# Altium project TechDemo.PrjPcb (part 2 of 2)

## Sheet Wifi.SchDoc: =ProjectTitle
size B; Date: 10/29/2020; Engineer: H. Collector; Organization: IMR Engineering; Address1: 3621 Gin Way; Address2: Snellville, GA 30039; Address3: USA; DocumentNumber: IMR_002; Revision: 1; SheetNumber: 9; SheetTotal: 10
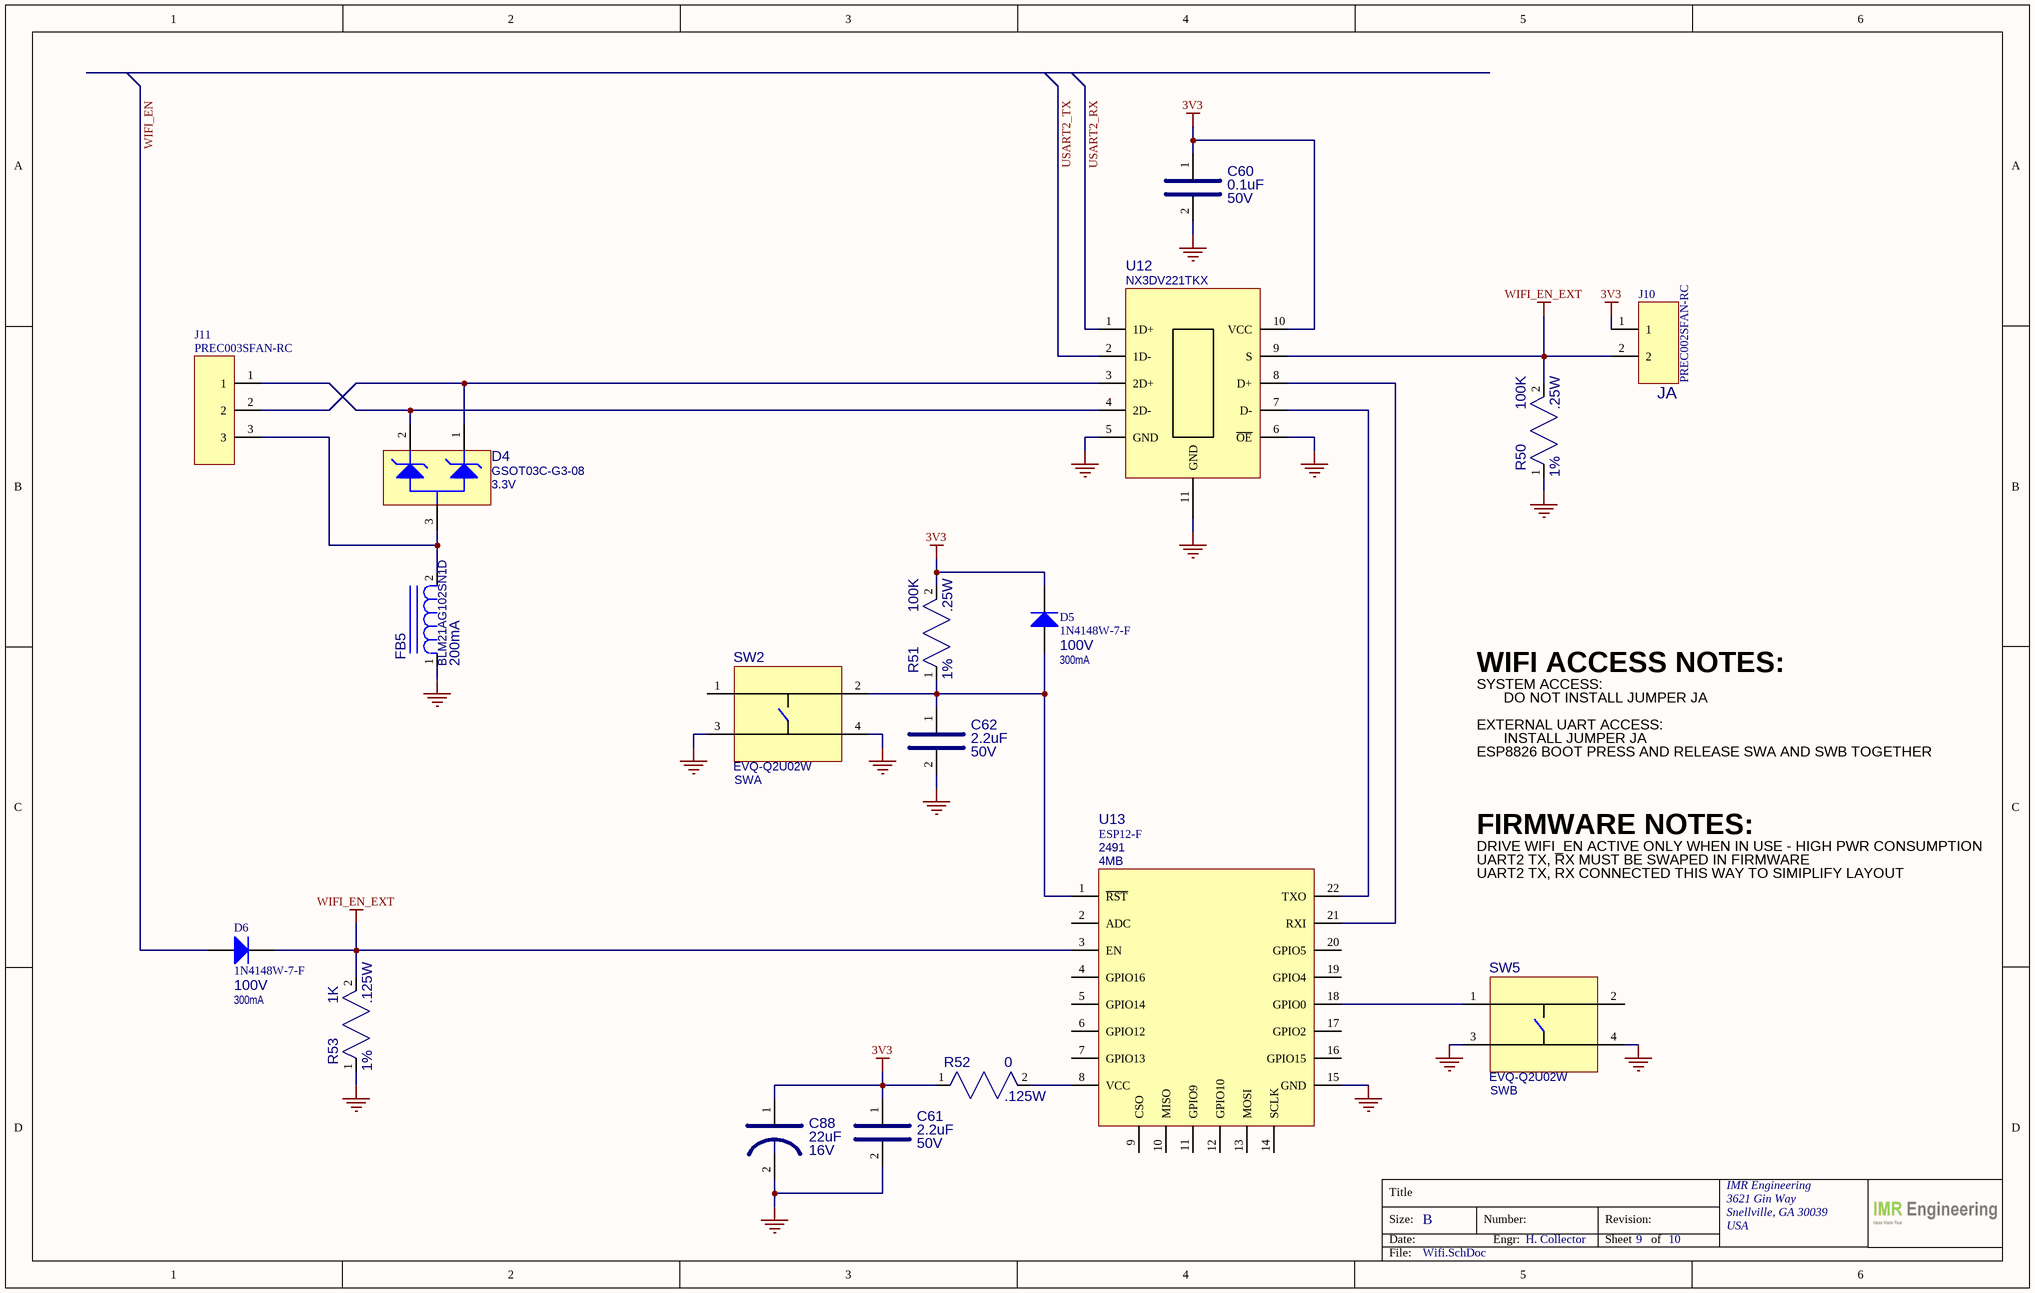
[diagram p8: Wifi.SchDoc]

### Parts
C60  value 0.1uF  VOLTAGE: 50V  [CAP_0805]  (hidden comment: 08055C104KAT2A)
C61  value 2.2uF  VOLTAGE: 50V  [CAP_0805]  (hidden comment: UMK212BB7225MG-T)
C62  value 2.2uF  VOLTAGE: 50V  [CAP_0805]  (hidden comment: UMK212BB7225MG-T)
C88  value 22uF  VOLTAGE: 16V  [CAP_2312]  (hidden comment: TRJC226K016RRJ)
D4  value 3.3V  [SOT-23]  (hidden comment: GSOT03C-G3-08)
D5  value 100V  CURRENT: 300mA  [SOD123]  (hidden comment: 1N4148W-7-F)
D6  value 100V  CURRENT: 300mA  [SOD123]  (hidden comment: 1N4148W-7-F)
FB5  value 200mA  [RES_0805]  (hidden comment: BLM21AG102SN1D)
J10  PREC002SFAN-RC  OPERATION_NOTE: JA  [HDR_1X2_100MILL]
J11  PREC003SFAN-RC  [HDR_1X3_100MILL]
R50  value 100K  TOLERANCE: 1%  POWER: .25W  [PMG_RES_0805]  (hidden comment: RK73H2ATTD1003F)
R51  value 100K  TOLERANCE: 1%  POWER: .25W  [PMG_RES_0805]  (hidden comment: RK73H2ATTD1003F)
R52  value 0  POWER: .125W  [PMG_RES_0805]  (hidden comment: RC0805JR-070RL)
R53  value 1K  TOLERANCE: 1%  POWER: .125W  [RES_0805]  (hidden comment: RC0805FR-071KL)
SW2  OPERATION_NOTE: SWA  [SW_EVQ-Q2U02W]  (hidden comment: EVQ-Q2U02W)
SW5  OPERATION_NOTE: SWB  [SW_EVQ-Q2U02W]  (hidden comment: EVQ-Q2U02W)
U12  NX3DV221TKX  [PMG_NX3DV221TKX]
U13  PACKAGE: ESP12-F  FLASH: 4MB  [XCVR_ESP8266-12E/ESP-12E]  (hidden comment: 2491)

### Nets
3V3: C60.1 C61.1 C88.1 D5.2(K) J10.1 R51.2 R52.1 U12.10(VCC)
GND: C60.2 C61.2 C62.2 C88.2 FB5.1 R50.1 R53.1 SW2.3(A) SW2.4(A') SW5.3(A) SW5.4(A') U12.5(GND) U12.6(~{OE}) U12.11(GND) U13.15(GND)
WIFI_EN_EXT: D6.2(K) J10.2 R50.2 R53.2 U12.9(S) U13.3(EN)
USART2_RX: U12.1(1D+)
USART2_TX: U12.2(1D-)
WIFI_EN: D6.1(A)
NetC62_1: C62.1 D5.1(A) R51.1 SW2.2(B') U13.1(~{RST})
NetD4_1: D4.1(A1) J11.2 U12.3(2D+)
NetD4_2: D4.2(A2) J11.1 U12.4(2D-)
NetD4_3: D4.3(A) FB5.2 J11.3
NetR52_2: R52.2 U13.8(VCC)
NetSW5_1: SW5.1(B) U13.18(GPIO0)
NetU12_7: U12.7(D-) U13.22(TXO)
NetU12_8: U12.8(D+) U13.21(RXI)

Not connected (* = marked no-connect by the designer): SW2 1(B); SW5 2(B'); U13 2(ADC) 4(GPIO16) 5(GPIO14) 6(GPIO12) 7(GPIO13) 9(CSO) 10(MISO) 11(GPIO9) 12(GPIO10) 13(MOSI) 14(SCLK) 16(GPIO15) 17(GPIO2) 19(GPIO4) 20(GPIO5)

### Notes on the sheet
- WIFI ACCESS NOTES:
- SYSTEM ACCESS:
- DO NOT INSTALL JUMPER JA
- EXTERNAL UART ACCESS:
- ESP8826 BOOT PRESS AND RELEASE SWA AND SWB TOGETHER
- INSTALL JUMPER JA
- FIRMWARE NOTES:
- DRIVE WIFI_EN ACTIVE ONLY WHEN IN USE - HIGH PWR CONSUMPTION
- UART2 TX, RX MUST BE SWAPED IN FIRMWARE
- UART2 TX, RX CONNECTED THIS WAY TO SIMIPLIFY LAYOUT
- Title
- Size:
- Date:
- B
- Number:
- Engr:
- Revision:
- Sheet
- of
- File:

### Library data of the parts
C60 = CAP_0.1UF_50V_0805: CAP CER 0.1UF 50V X7R 0805; MFG: AVX; TOLERANCE: 10%; MFG_PN: 08055C104KAT2A; Supplier 1: Digi-Key; Supplier Part Number 1: 478-1395-1-ND; Case/Package: 0805
C61 C62 = CAP_2.2UF_50V_0805: CAP CER 2.2UF 50V X7R 0805; MFG: Taiyo Yuden; TOLERANCE: 20%; MFG_PN: UMK212BB7225MG-T; Supplier 1: Digi-Key; Supplier Part Number 1: 587-4963-1-ND; Case/Package: 0805
C88 = CAP_22UF_16V_TANT: CAP TANT 22UF 10% 16V 2312; MFG: AVX Corporation; MFG_PN: TRJC226K016RRJ; TOLERANCE: 10%; Supplier 1: Digi-Key; Supplier Part Number 1: 478-11127-1-ND
D4 = DIODE_TVS_GSOT03C-G3-08: TVS DIODE 3.3V 12.3V SOT23; MFG: Vishay Semiconductor; POWER: 30A (8/20us); Case/Package: SOT-23; Supplier 1: Digi-Key; Supplier Part Number 1: GSOT03C-G3-08GICT-ND; MFG_PN: GSOT03C-G3-08
D5 D6 = DIODE_1N4148W-7-F: DIODE GEN PURP 100V 300MA SOD123; MFG: Diodes Incorporated; Case/Package: SOD-123; Supplier 1: Digi-Key; Supplier Part Number 1: 1N4148W-FDICT-ND; MFG_PN: 1N4148W-7-F
FB5 = FERRITE_BLM21AG102SN1D: FERRITE, 1KOHM AT 100MHZ, 220MA, .450DCR; MFG: MURATA; TOLERANCE: 10%; Supplier 1: Digi-Key; Supplier Part Number 1: 490-1041-1-ND; MFG_PN: BLM21AG102SN1D
J10 = CONN_2P_SINGLE_ROW: CONN HEADER VERT 2POS 2.54MM; MFG: Sullins Connector Solutions; Case/Package: 2P_2.54MM; MFG_PN: PREC002SFAN-RC; Supplier 1: Digi-Key; Supplier Part Number 1: S1212EC-02-ND; Value: *
J11 = CONN_3P_SINGLE_ROW: CONN HEADER VERT 3POS 2.54MM; MFG: Sullins Connector Solutions; Case/Package: 3P_2.54MM; MFG_PN: PREC003SFAN-RC; Supplier 1: Digi-Key; Supplier Part Number 1: S1212EC-03-ND; Value: *
R50 R51 = RES_100K_0805_1/4W_1%: RES SMD 100K OHM 1% 1/4W 0805; MFG: KOA Speer Electronics, Inc.; Case/Package: 0805; MFG_PN: RK73H2ATTD1003F; Supplier 1: Digi-Key; Supplier Part Number 1: 2019-RK73H2ATTD1003FCT-ND
R52 = RES_0_0805_1/8W: RES SMD 0 OHM JUMPER 1/8W 0805; MFG: Yageo; Case/Package: 0805; MFG_PN: RC0805JR-070RL; Supplier 1: Digi-Key; Supplier Part Number 1: 311-0.0ARCT-ND; TOLERANCE: JUMPER
R53 = RES_1K_0805_1/8W_1%: RES SMD 1K OHM 1% 1/8W 0805; MFG: Yageo; Case/Package: 0805; MFG_PN: RC0805FR-071KL; Supplier 1: Digi-Key; Supplier Part Number 1: 311-1.00KCRCT-ND
SW2 SW5 = SWITCH_EVQ-Q2U02W: SWITCH TACTILE SPST-NO 0.02A 15V; MFG: Panasonic Electronic Components; Case/Package: EVQ-Q2; Supplier 1: Digi-Key; Supplier Part Number 1: P12954SCT-ND; VALUE: 15V; MFG_PN: EVQ-Q2U02W
U12 = IC_NX3DV221TKX: IC USB 2.0 SWITCH HS 10HVSON; MFG: NXP USA Inc.; Case/Package: 10-DFN; Supplier 1: Digi-Key; Supplier Part Number 1: 568-10368-1-ND; MFG_PN: NX3DV221TKX
U13 = MODULE_2491: RX TXRX MOD WIFI TRACE ANT SMD 4MB; MFG: Adafruit Industries LLC; Supplier 1: Digi-Key; Supplier Part Number 1: 1528-1438-ND; Case/Package: ESP-12F; MFG_PN: 2491

## Sheet Power.SchDoc: =ProjectTitle
size B; Date: 10/29/2020; Engineer: H. Collector; Organization: IMR Engineering; Address1: 3621 Gin Way; Address2: Snellville, GA 30039; Address3: USA; DocumentNumber: IMR_002; Revision: 1; SheetNumber: 10; SheetTotal: 10
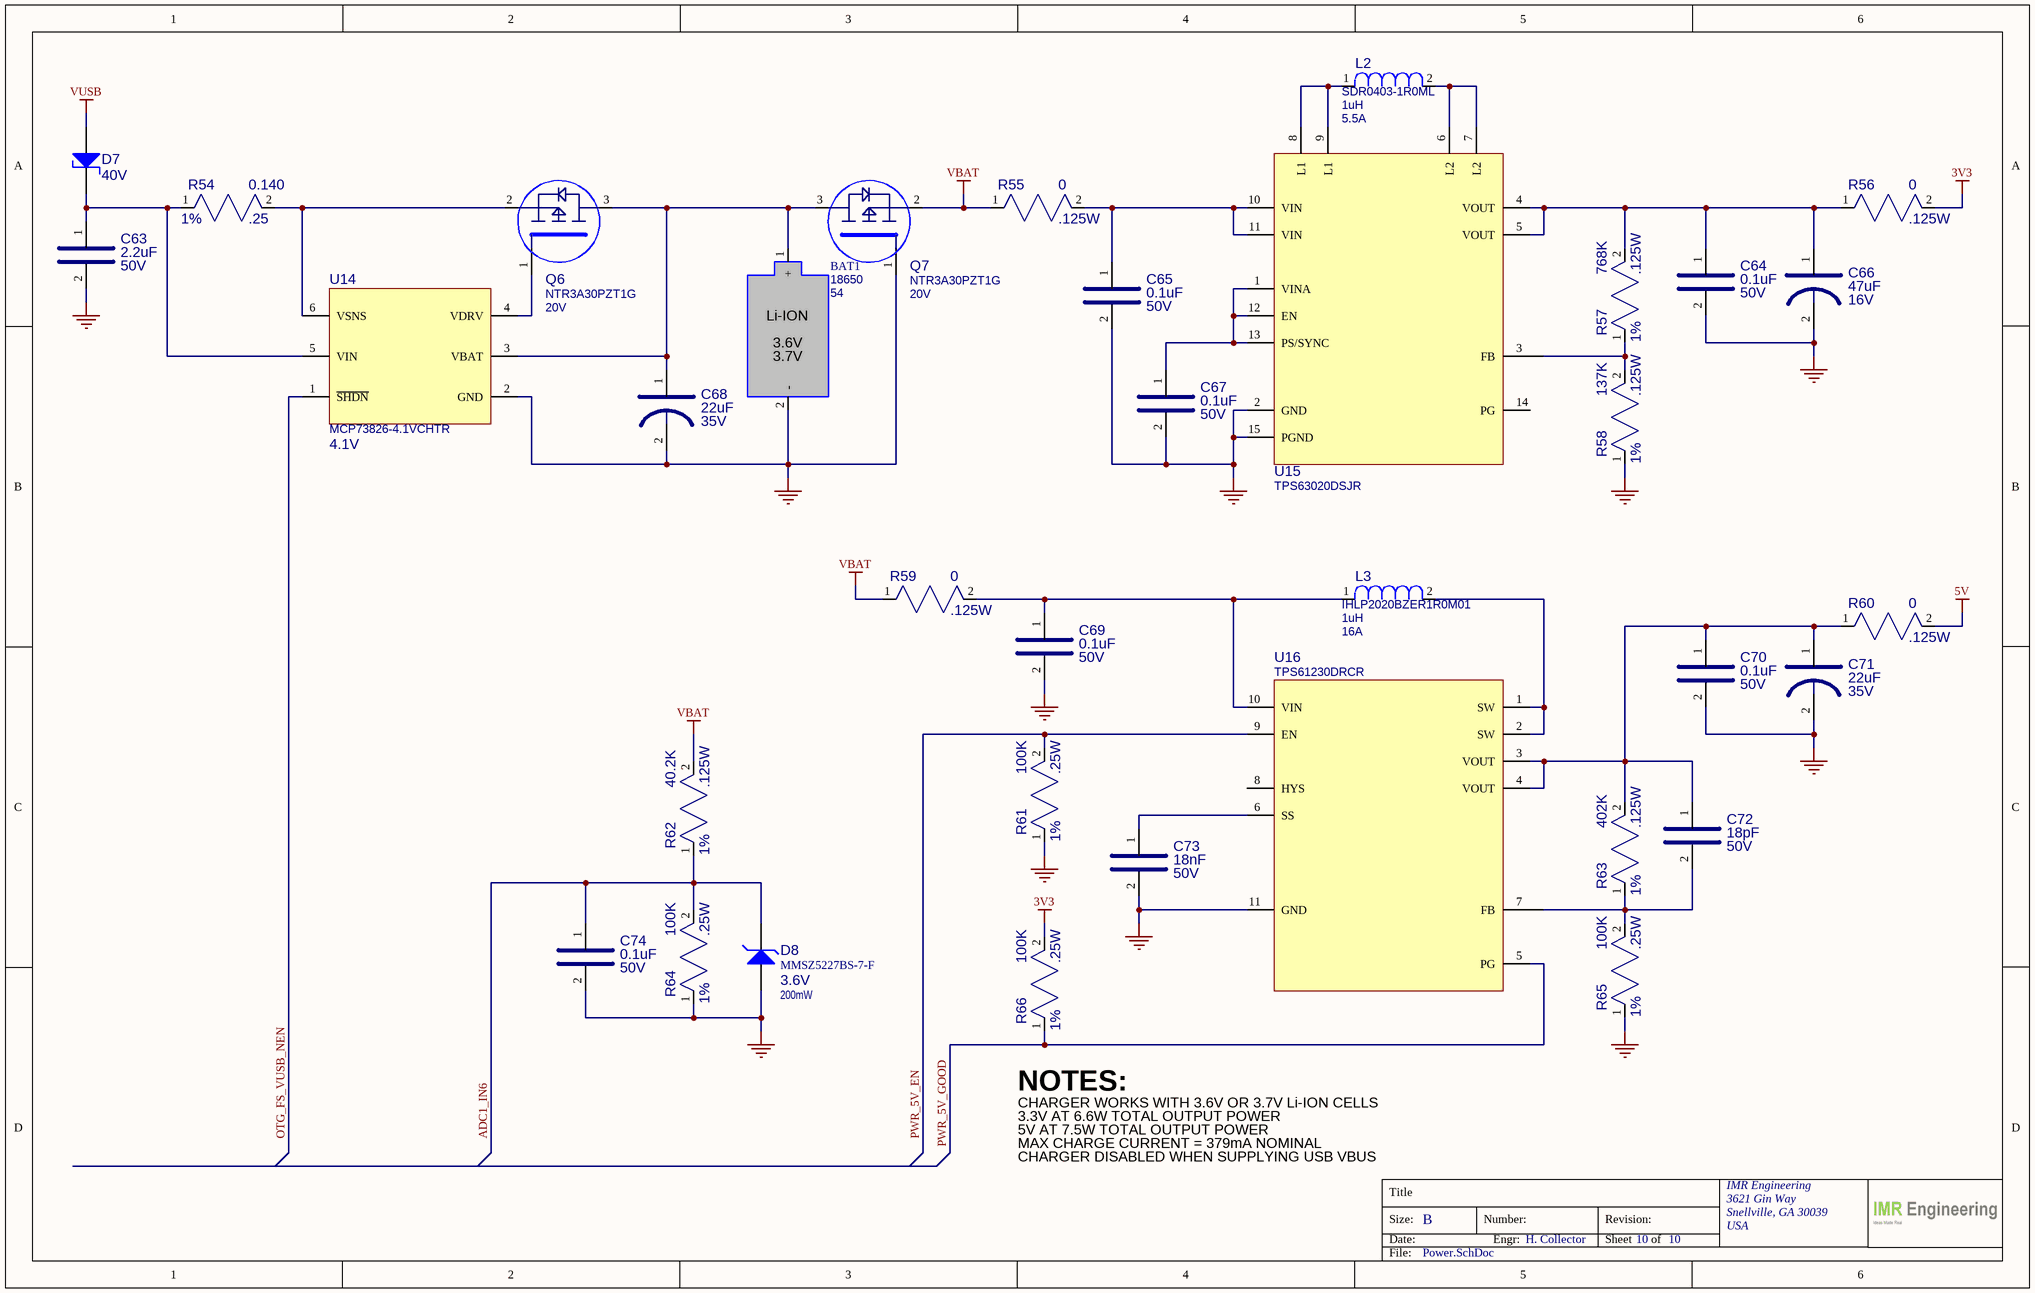
[diagram p9: Power.SchDoc]

### Parts
BAT1  value 18650  [CONN_BATTERY_18650]  (hidden comment: 54)
C63  value 2.2uF  VOLTAGE: 50V  [CAP_0805]  (hidden comment: UMK212BB7225MG-T)
C64  value 0.1uF  VOLTAGE: 50V  [CAP_0805]  (hidden comment: 08055C104KAT2A)
C65  value 0.1uF  VOLTAGE: 50V  [CAP_0805]  (hidden comment: 08055C104KAT2A)
C66  value 47uF  VOLTAGE: 16V  [CAP_ALE_SMD_6.6x6.6]  (hidden comment: UCL1C470MCL6GS)
C67  value 0.1uF  VOLTAGE: 50V  [CAP_0805]  (hidden comment: 08055C104KAT2A)
C68  value 22uF  VOLTAGE: 35V  [CAP_ALE_SMD_6.6x6.6]  (hidden comment: UZS1C220MCL1GB)
C69  value 0.1uF  VOLTAGE: 50V  [CAP_0805]  (hidden comment: 08055C104KAT2A)
C70  value 0.1uF  VOLTAGE: 50V  [CAP_0805]  (hidden comment: 08055C104KAT2A)
C71  value 22uF  VOLTAGE: 35V  [CAP_ALE_SMD_6.6x6.6]  (hidden comment: UZS1C220MCL1GB)
C72  value 18pF  VOLTAGE: 50V  [CAP_0805]  (hidden comment: CML0805C0G180JT50V)
C73  value 18nF  VOLTAGE: 50V  [CAP_0805]  (hidden comment: CC0805KRX7R9BB183)
C74  value 0.1uF  VOLTAGE: 50V  [CAP_0805]  (hidden comment: 08055C104KAT2A)
D7  value 40V  [SMB]  (hidden comment: MBRS2040LT3G)
D8  value 3.6V  POWER: 200mW  [SOD323]  (hidden comment: MMSZ5227BS-7-F)
L2  value 1uH  Current: 5.5A  [IND_SDR0403]  (hidden comment: SDR0403-1R0ML)
L3  value 1uH  Current: 16A  [INDPM5552X200N]  (hidden comment: IHLP2020BZER1R0M01)
Q6  value 20V  [SOT-23]  (hidden comment: NTR3A30PZT1G)
Q7  value 20V  [SOT-23]  (hidden comment: NTR3A30PZT1G)
R54  value 0.140  TOLERANCE: 1%  POWER: .25  [1206]  (hidden comment: RL1206FR-070R14L)
R55  value 0  POWER: .125W  [PMG_RES_0805]  (hidden comment: RC0805JR-070RL)
R56  value 0  POWER: .125W  [PMG_RES_0805]  (hidden comment: RC0805JR-070RL)
R57  value 768K  TOLERANCE: 1%  POWER: .125W  [PMG_RES_0805]  (hidden comment: RC0805FR-07768KL)
R58  value 137K  TOLERANCE: 1%  POWER: .125W  [PMG_RES_0805]  (hidden comment: RC0805FR-07137KL)
R59  value 0  POWER: .125W  [PMG_RES_0805]  (hidden comment: RC0805JR-070RL)
R60  value 0  POWER: .125W  [PMG_RES_0805]  (hidden comment: RC0805JR-070RL)
R61  value 100K  TOLERANCE: 1%  POWER: .25W  [PMG_RES_0805]  (hidden comment: RK73H2ATTD1003F)
R62  value 40.2K  TOLERANCE: 1%  POWER: .125W  [RES_0805]  (hidden comment: RC0805FR-0740K2L)
R63  value 402K  TOLERANCE: 1%  POWER: .125W  [RES_0805]  (hidden comment: RC0805FR-07402KL)
R64  value 100K  TOLERANCE: 1%  POWER: .25W  [PMG_RES_0805]  (hidden comment: RK73H2ATTD1003F)
R65  value 100K  TOLERANCE: 1%  POWER: .25W  [PMG_RES_0805]  (hidden comment: RK73H2ATTD1003F)
R66  value 100K  TOLERANCE: 1%  POWER: .25W  [PMG_RES_0805]  (hidden comment: RK73H2ATTD1003F)
U14  value 4.1V  [SOT23-6]  (hidden comment: MCP73826-4.1VCHTR)
U15  TPS63020DSJR  [14VSON]
U16  TPS61230DRCR  [10VSON]

### Nets
3V3: R56.2 R66.2
5V: R60.2
GND: BAT1.2(-) C63.2 C64.2 C65.2 C66.2 C67.2 C68.2 C69.2 C70.2 C71.2 C73.2 C74.2 D8.1(A) Q7.1(B) R58.1 R61.1 R64.1 R65.1 U14.2(GND) U15.2(GND) U15.15(PGND) U16.11(GND)
VBAT: Q7.2(E) R55.1 R59.1 R62.2
VUSB: D7.1(A)
ADC1_IN6: C74.1 D8.2(K) R62.1 R64.2
OTG_FS_VUSB_NEN: U14.1(~{SHDN})
PWR_5V_EN: R61.2 U16.9(EN)
PWR_5V_GOOD: R66.1 U16.5(PG)
NetBAT1_1: BAT1.1(+) C68.1 Q6.3(C) Q7.3(C) U14.3(VBAT)
NetC63_1: C63.1 D7.2(K) R54.1 U14.5(VIN)
NetC64_1: C64.1 C66.1 R56.1 R57.2 U15.4(VOUT) U15.5(VOUT)
NetC65_1: C65.1 R55.2 U15.10(VIN) U15.11(VIN)
NetC67_1: C67.1 U15.1(VINA) U15.12(EN) U15.13(PS/SYNC)
NetC69_1: C69.1 L3.1 R59.2 U16.10(VIN)
NetC70_1: C70.1 C71.1 C72.1 R60.1 R63.2 U16.3(VOUT) U16.4(VOUT)
NetC72_2: C72.2 R63.1 R65.2 U16.7(FB)
NetC73_1: C73.1 U16.6(SS)
NetL2_1: L2.1 U15.8(L1) U15.9(L1)
NetL2_2: L2.2 U15.6(L2) U15.7(L2)
NetL3_2: L3.2 U16.1(SW) U16.2(SW)
NetQ6_1: Q6.1(B) U14.4(VDRV)
NetQ6_2: Q6.2(E) R54.2 U14.6(VSNS)
NetR57_1: R57.1 R58.2 U15.3(FB)

Not connected (* = marked no-connect by the designer): U15 14(PG); U16 8(HYS)

### Notes on the sheet
- (near R66) NOTES:
- CHARGER WORKS WITH 3.6V OR 3.7V Li-ION CELLS
- 3.3V AT 6.6W TOTAL OUTPUT POWER
- 5V AT 7.5W TOTAL OUTPUT POWER
- MAX CHARGE CURRENT = 379mA NOMINAL
- CHARGER DISABLED WHEN SUPPLYING USB VBUS
- Title
- Size:
- Date:
- B
- Number:
- Engr:
- Revision:
- Sheet
- of
- File:
- (in symbol CONN_BATTERY_18650) Li-ION; 3.6V; 3.7V

### Library data of the parts
BAT1 = CONN_BATTERY_18650: BATTERY CONTACT CLP 18650 PC PIN (NOTE: QTY x2); MFG: Keystone Electronics; Case/Package: 2P_2.54MM; Supplier 1: Digi-Key; Supplier Part Number 1: 36-54-ND; MFG_PN: 54
C63 = CAP_2.2UF_50V_0805: as C61 on sheet Wifi; MFG_PN: UMK212BB7225MG-T; Supplier 1: Digi-Key; Supplier Part Number 1: 587-4963-1-ND; Case/Package: 0805; ClassName: Power_Charger
C64 C65 C67 C69 C70 C74 = CAP_0.1UF_50V_0805: as C60 on sheet Wifi; MFG_PN: 08055C104KAT2A; Supplier 1: Digi-Key; Supplier Part Number 1: 478-1395-1-ND; Case/Package: 0805
  C64 C67: ClassName: Power_3V3; Parameter 1: *
  C65: ClassName: Power_3V3
  C69 C70: ClassName: Power_5V
  C74: ClassName: Power_VBAT_Monitor
C66 = CAP_47UF_16V_ALE_NF: CAP ALUM 47UF 20% 16V SMD; MFG: NICHICON; MFG_PN: UCL1C470MCL6GS; TOLERANCE: 20%; Supplier 1: Digi-Key; Supplier Part Number 1: 493-3916-1-ND
C68 C71 = CAP_22UF_35V_ALE_NF: CAP, AL E, 22UF, 35V, 20%, ROHS; MFG: NICHICON; MFG_PN: UZS1C220MCL1GB; TOLERANCE: 20%; Supplier 1: Digi-Key; Supplier Part Number 1: 493-10138-1-ND
  C71: ClassName: Power_5V
C72 = CAP_18PF_50V_0805: CAP CER 18PF 50V C0G/NP0 0805; MFG: Stackpole Electronics Inc; TOLERANCE: 5%; MFG_PN: CML0805C0G180JT50V; Supplier 1: Digi-Key; Supplier Part Number 1: 738-CML0805C0G180JT50VCT-ND; Case/Package: 0805; ClassName: Power_5V
C73 = CAP_18NF_50V_0805: CAP CER 0.018UF 50V X7R 0805; MFG: Yageo; TOLERANCE: 10%; MFG_PN: CC0805KRX7R9BB183; Supplier 1: Digi-Key; Supplier Part Number 1: 311-1137-1-ND; Case/Package: 0805; ClassName: Power_5V
D7 = DIODE_SCHOTTKY_MBRS2040LT3G: DIODE SCHOTTKY 40V 2A SMB; MFG: ON SEMICONDUCTOR; PackageReference: DO-35; ComponentLink1Description: Manufacturer Link; ComponentLink1URL: http://www.fairchildsemi.com/; ComponentLink2Description: Datasheet; ComponentLink2URL: http://www.fairchildsemi.com/ds/1N%2F1N4148.pdf; Supplier 1: Digi-Key; Supplier Part Number 1: MBRS2040LT3GOSCT-ND; MFG_PN: MBRS2040LT3G; Current: 2A; Case/Package: SMB; ClassName: Power_Charger
D8 = DIODE_ZENER_MMSZ5227BS-7-F: DIODE ZENER 3.6V 200MW SOD323; MFG: Vishay Semiconductor; Case/Package: SOD323; Supplier 1: Digi-Key; Supplier Part Number 1: MMSZ5227BS-FDICT-ND; MFG_PN: MMSZ5227BS-7-F; ClassName: Power_VBAT_Monitor
L2 = INDUCTOR_SDR0403-1R0ML: FIXED IND 1UH 3.8A 33 MOHM SMD; MFG: Bourns Inc.; TOLERANCE: 20%; Supplier 1: Digi-Key; Supplier Part Number 1: SDR0403-1R0MLCT-ND; MFG_PN: SDR0403-1R0ML; ClassName: Power_3V3; Parameter 1: *
L3 = INDUCTOR_IHLP2020BZER1R0M01: FIXED IND 1UH 3.8A 33 MOHM SMD; MFG: Bourns Inc.; TOLERANCE: 20%; Supplier 1: Digi-Key; Supplier Part Number 1: 541-1087-1-ND; MFG_PN: IHLP2020BZER1R0M01; ClassName: Power_5V
Q6 Q7 = MOSFET_PCH_NTR3A30PZT1G: MOSFET P-CH 20V 3A SOT23-3; MFG: ON Semiconductor; ComponentLink1Description: Manufacturer Link; ComponentLink1URL: http://www.fairchildsemi.com/; ComponentLink2Description: Datasheet; ComponentLink2URL: http://www.fairchildsemi.com/ds/2N%2F2N3904.pdf; Supplier 1: Digi-Key; Supplier Part Number 1: NTR3A30PZT1GOSCT-ND; MFG_PN: NTR3A30PZT1G
  Q6: ClassName: Power_Charger
  Q7: ClassName: Power_VBAT_Monitor
R54 = RES_0.140_1206_1/4W_1%: RES 0.14 OHM 1% 1/4W 1206; MFG: Yageo; Case/Package: 1206; MFG_PN: RL1206FR-070R14L; Supplier 1: Digi-Key; Supplier Part Number 1: 311-.14LWCT-ND; ClassName: Power_Charger
R55 R56 R59 R60 = RES_0_0805_1/8W: as R52 on sheet Wifi; Case/Package: 0805; MFG_PN: RC0805JR-070RL; Supplier 1: Digi-Key; Supplier Part Number 1: 311-0.0ARCT-ND; TOLERANCE: JUMPER
  R55 R56: ClassName: Power_3V3; Parameter 1: *
  R59 R60: ClassName: Power_5V
R57 = RES_768K_0805_1/8W_1%: RES SMD 768K OHM 1% 1/8W 0805; MFG: Yageo; Case/Package: 0805; MFG_PN: RC0805FR-07768KL; Supplier 1: Digi-Key; Supplier Part Number 1: 311-768KCRCT-ND; ClassName: Power_3V3; Parameter 1: *
R58 = RES_137K_0805_1/8W_1%: RES SMD 137K OHM 1% 1/8W 0805; MFG: Yageo; Case/Package: 0805; MFG_PN: RC0805FR-07137KL; Supplier 1: Digi-Key; Supplier Part Number 1: 311-137KCRCT-ND; ClassName: Power_3V3; Parameter 1: *
R61 R64-R66 = RES_100K_0805_1/4W_1%: as R50 on sheet Wifi; Case/Package: 0805; MFG_PN: RK73H2ATTD1003F; Supplier 1: Digi-Key; Supplier Part Number 1: 2019-RK73H2ATTD1003FCT-ND
  R61 R65 R66: ClassName: Power_5V
  R64: ClassName: Power_VBAT_Monitor
R62 = RES_40.2K_0805_1/8W_1%_1: RES SMD 40.2K OHM 1% 1/8W 0805; MFG: Yageo; Case/Package: 0805; MFG_PN: RC0805FR-0740K2L; Supplier 1: Digi-Key; Supplier Part Number 1: 311-40.2KCRCT-ND; ClassName: Power_VBAT_Monitor
R63 = RES_402K_0805_1/8W_1%: RES SMD 402K OHM 1% 1/8W 0805; MFG: Yageo; Case/Package: 0805; MFG_PN: RC0805FR-07402KL; Supplier 1: Digi-Key; Supplier Part Number 1: 311-402KCRCT-ND; ClassName: Power_5V
U14 = IC_MCP73826-4.1VCHTR: IC CONTROLLR LI-ION 4.1V SOT23-6; MFG: Microchip Technology; Supplier 1: Digi-Key; Supplier Part Number 1: MCP73826-4.1VCHCT-ND; MFG_PN: MCP73826-4.1VCHTR; ClassName: Power_Charger
U15 = IC_TPS63020DSJR: IC REG BCK BST ADJ 3.5A 14VSON; MFG: Texas Instruments; Case/Package: 14VSON; Supplier 1: Digi-Key; VALUE: 3.5A; Supplier Part Number 1: 296-36491-1-ND; MFG_PN: TPS63020DSJR; ClassName: Power_3V3; Parameter 1: *
U16 = IC_TPS61230DRCR: IC REG BOOST ADJ 4A 10VSON; MFG: Texas Instruments; Case/Package: 10VSON; Supplier 1: Digi-Key; VALUE: 4A; Supplier Part Number 1: 296-37761-1-ND; MFG_PN: TPS61230DRCR; ClassName: Power_5V

## Nets that join several sheets
3V3: MainController (6 pins), MainControllerPower (39 pins), SystemMemory (35 pins), LCD_TouchBackLight (7 pins), SerialInterface (Q2.1 R35.2 R36.2 R37.2), UserInteractive (15 pins), AudioAmp (10 pins), Wifi (8 pins), Power (R56.2 R66.2)
5V: SerialInterface (U6.2 U6.3), UserInteractive (J8.18), Power (R60.2)
GND: MainController (12 pins), MainControllerPower (46 pins), SystemMemory (51 pins), LCD_TouchBackLight (15 pins), SerialInterface (10 pins), UserInteractive (18 pins), AudioAmp (10 pins), Wifi (15 pins), Power (22 pins)
VB1: LCD_TouchBackLight (5 pins), UserInteractive (J8.10 J8.11)
VBAT: MainControllerPower (C81.1 R78.1 U17.1), Power (Q7.2 R55.1 R59.1 R62.2)
VUSB: SerialInterface (J6.1 Q1.2 R34.2 U5.5), Power (D7.1)
ACEL_NEN: MainController (U1.152), UserInteractive (R45.1 U7.8)
ADC1_IN5: MainController (U1.51), UserInteractive (C52.1 R44.2)
ADC1_IN6: MainController (U1.52), Power (C74.1 D8.2 R62.1 R64.2)
AUDIO_EN: MainController (U1.176), AudioAmp (Q5.1 R48.2 U10.5)
DAC_OUT1: MainController (U1.50), AudioAmp (C54.1)
DISPLAY_EN: MainController (U1.132), LCD_TouchBackLight (J4.31)
FMC_A0: MainController (U1.16), SystemMemory (U2.25)
FMC_A1: MainController (U1.17), SystemMemory (U2.26)
FMC_A2: MainController (U1.18), SystemMemory (U2.27)
FMC_A3: MainController (U1.19), SystemMemory (U2.60)
FMC_A4: MainController (U1.20), SystemMemory (U2.61)
FMC_A5: MainController (U1.21), SystemMemory (U2.62)
FMC_A6: MainController (U1.60), SystemMemory (U2.63)
FMC_A7: MainController (U1.63), SystemMemory (U2.64)
FMC_A8: MainController (U1.64), SystemMemory (U2.65)
FMC_A9: MainController (U1.65), SystemMemory (U2.66)
FMC_A10: MainController (U1.66), SystemMemory (U2.24)
FMC_A11: MainController (U1.67), SystemMemory (U2.21)
FMC_BA0: MainController (U1.108), SystemMemory (U2.22)
FMC_BA1: MainController (U1.109), SystemMemory (U2.23)
FMC_D0: MainController (U1.104), SystemMemory (U2.2)
FMC_D1: MainController (U1.105), SystemMemory (U2.4)
FMC_D2: MainController (U1.142), SystemMemory (U2.5)
FMC_D3: MainController (U1.143), SystemMemory (U2.7)
FMC_D4: MainController (U1.68), SystemMemory (U2.8)
FMC_D5: MainController (U1.69), SystemMemory (U2.10)
FMC_D6: MainController (U1.70), SystemMemory (U2.11)
FMC_D7: MainController (U1.73), SystemMemory (U2.13)
FMC_D8: MainController (U1.74), SystemMemory (U2.74)
FMC_D9: MainController (U1.75), SystemMemory (U2.76)
FMC_D10: MainController (U1.76), SystemMemory (U2.77)
FMC_D11: MainController (U1.77), SystemMemory (U2.79)
FMC_D12: MainController (U1.78), SystemMemory (U2.80)
FMC_D13: MainController (U1.96), SystemMemory (U2.82)
FMC_D14: MainController (U1.97), SystemMemory (U2.83)
FMC_D15: MainController (U1.98), SystemMemory (U2.85)
FMC_NBL0: MainController (U1.169), SystemMemory (U2.16)
FMC_NBL1: MainController (U1.170), SystemMemory (U2.71)
FMC_SDCKE0: MainController (U1.35), SystemMemory (U2.67)
FMC_SDCLK: MainController (U1.112), SystemMemory (U2.68)
FMC_SDNCAS: MainController (U1.160), SystemMemory (U2.18)
FMC_SDNE0: MainController (U1.54), SystemMemory (U2.20)
FMC_SDNRAS: MainController (U1.59), SystemMemory (U2.19)
FMC_SDNWE: MainController (U1.32), SystemMemory (U2.17)
HEX_1: MainController (U1.151), UserInteractive (R43.1 SW1.1)
HEX_2: MainController (U1.146), UserInteractive (R42.1 SW1.2)
HEX_4: MainController (U1.147), UserInteractive (R41.1 SW1.4)
HEX_8: MainController (U1.145), UserInteractive (R40.1 SW1.8)
I2C1_SCL: MainController (U1.167), AudioAmp (R80.2 TP11.1 U9.3)
I2C1_SDA: MainController (U1.165), AudioAmp (R79.2 TP12.1 U9.4)
I2C2_SCL: MainController (U1.45), UserInteractive (J8.4)
I2C2_SDA: MainController (U1.46), UserInteractive (J8.5)
I2C3_SCL: MainController (U1.84), LCD_TouchBackLight (J5.3 R89.1 TP4.1)
I2C3_SDA: MainController (U1.85), LCD_TouchBackLight (J5.4 R88.1 TP5.1)
LTDC_B0: MainController (U1.3), LCD_TouchBackLight (J4.21)
LTDC_B1: MainController (U1.155), LCD_TouchBackLight (J4.22)
LTDC_B2: MainController (U1.150), LCD_TouchBackLight (J4.23)
LTDC_B3: MainController (U1.154), LCD_TouchBackLight (J4.24)
LTDC_B4: MainController (U1.173), LCD_TouchBackLight (J4.25)
LTDC_B5: MainController (U1.174), LCD_TouchBackLight (J4.26)
LTDC_B6: MainController (U1.175), LCD_TouchBackLight (J4.27)
LTDC_B7: MainController (U1.168), LCD_TouchBackLight (J4.28)
LTDC_CLK: MainController (U1.111), LCD_TouchBackLight (J4.30)
LTDC_DE: MainController (U1.28), LCD_TouchBackLight (J4.34)
LTDC_G0: MainController (U1.4), LCD_TouchBackLight (J4.13)
LTDC_G1: MainController (U1.5), LCD_TouchBackLight (J4.14)
LTDC_G2: MainController (U1.128), LCD_TouchBackLight (J4.15)
LTDC_G3: MainController (U1.129), LCD_TouchBackLight (J4.16)
LTDC_G4: MainController (U1.130), LCD_TouchBackLight (J4.17)
LTDC_G5: MainController (U1.131), LCD_TouchBackLight (J4.18)
LTDC_G6: MainController (U1.116), LCD_TouchBackLight (J4.19)
LTDC_G7: MainController (U1.133), LCD_TouchBackLight (J4.20)
LTDC_HSYNC: MainController (U1.12), LCD_TouchBackLight (J4.32)
LTDC_R0: MainController (U1.43), LCD_TouchBackLight (J4.5)
LTDC_R1: MainController (U1.44), LCD_TouchBackLight (J4.6)
LTDC_R2: MainController (U1.41), LCD_TouchBackLight (J4.7)
LTDC_R3: MainController (U1.56), LCD_TouchBackLight (J4.8)
LTDC_R4: MainController (U1.87), LCD_TouchBackLight (J4.9)
LTDC_R5: MainController (U1.88), LCD_TouchBackLight (J4.10)
LTDC_R6: MainController (U1.57), LCD_TouchBackLight (J4.11)
LTDC_R7: MainController (U1.110), LCD_TouchBackLight (J4.12)
LTDC_VSYNC: MainController (U1.11), LCD_TouchBackLight (J4.33)
MOD_IO0: MainController (U1.92), UserInteractive (J8.17)
MOD_IO1: MainController (U1.94), UserInteractive (J8.16)
NRST: MainController (5 pins), MainControllerPower (J1.5 J2.5)
OTG_FS_ID: MainController (U1.121), SerialInterface (J6.4 U5.3)
OTG_FS_N: MainController (U1.122), SerialInterface (R29.2)
OTG_FS_P: MainController (U1.123), SerialInterface (R30.2)
OTG_FS_VUSB_NEN: MainController (U1.119), SerialInterface (R35.1 U6.4), Power (U14.1)
OTG_FS_VUSB_NER: MainController (U1.134), SerialInterface (R36.1 U6.5)
PWM_DISPLAY: MainController (U1.138), LCD_TouchBackLight (R81.1 TP3.1 U4.4)
PWM_GLED: MainController (U1.100), UserInteractive (Q4.1)
PWM_RLED: MainController (U1.101), UserInteractive (Q3.1)
PWR_5V_EN: MainController (U1.156), Power (R61.2 U16.9)
PWR_5V_GOOD: MainController (U1.157), Power (R66.1 U16.5)
QUADSPI_BK1_IO0: MainController (U1.26), SystemMemory (U3.5)
QUADSPI_BK1_IO1: MainController (U1.27), SystemMemory (U3.2)
QUADSPI_BK1_IO2: MainController (U1.25), SystemMemory (U3.3)
QUADSPI_BK1_IO3: MainController (U1.24), SystemMemory (U3.7)
QUADSPI_CLK: MainController (U1.58), SystemMemory (U3.6)
QUADSPI_NCS: MainController (U1.164), SystemMemory (R10.1 U3.1)
SDMMC1_CLK: MainController (U1.141), SystemMemory (J3.5)
SDMMC1_CMD: MainController (U1.144), SystemMemory (J3.3 R73.1)
SDMMC1_D0: MainController (U1.117), SystemMemory (J3.7 R69.1)
SDMMC1_D1: MainController (U1.118), SystemMemory (J3.8 R70.1)
SDMMC1_D2: MainController (U1.139), SystemMemory (J3.1 R71.1)
SDMMC1_D3: MainController (U1.140), SystemMemory (J3.2 R72.1)
SPI1_MISO: MainController (U1.162), UserInteractive (TP10.1 U7.7)
SPI1_MOSI: MainController (U1.163), UserInteractive (TP9.1 U7.6)
SPI1_SCK: MainController (U1.161), UserInteractive (TP8.1 U7.4)
SPI2_MISO: MainController (U1.34), UserInteractive (J8.7)
SPI2_MOSI: MainController (U1.33), UserInteractive (J8.6)
SPI2_SCK: MainController (U1.93), UserInteractive (J8.9)
STM_SWCLK: MainController (U1.137), MainControllerPower (J1.2 J2.2)
STM_SWDIO: MainController (U1.124), MainControllerPower (J1.4 J2.4)
TOUCH_IRQ: MainController (U1.83), LCD_TouchBackLight (J5.5 TP6.1)
TOUCH_NRST: MainController (U1.86), LCD_TouchBackLight (J5.6 TP7.1)
TYPE_ID0: MainController (U1.95), UserInteractive (J8.15 R75.1)
TYPE_ID1: MainController (U1.99), UserInteractive (J8.14 R74.1)
US_ECHO: MainController (U1.2), UserInteractive (U8.3)
US_TRIG: MainController (U1.1), UserInteractive (U8.2)
USART2_RX: MainController (U1.47), Wifi (U12.1)
USART2_TX: MainController (U1.42), Wifi (U12.2)
USART3_RX: MainController (U1.80), SerialInterface (D3.1 J7.2), UserInteractive (J8.2)
USART3_TX: MainController (U1.79), SerialInterface (D3.2 J7.1), UserInteractive (J8.1)
USD_DET: MainController (U1.8), SystemMemory (J3.SW-B R27.2)
WIFI_EN: MainController (U1.40), Wifi (D6.1)